# Altium schematic sheet STM32H743VIT6_Core.SchDoc
size A2
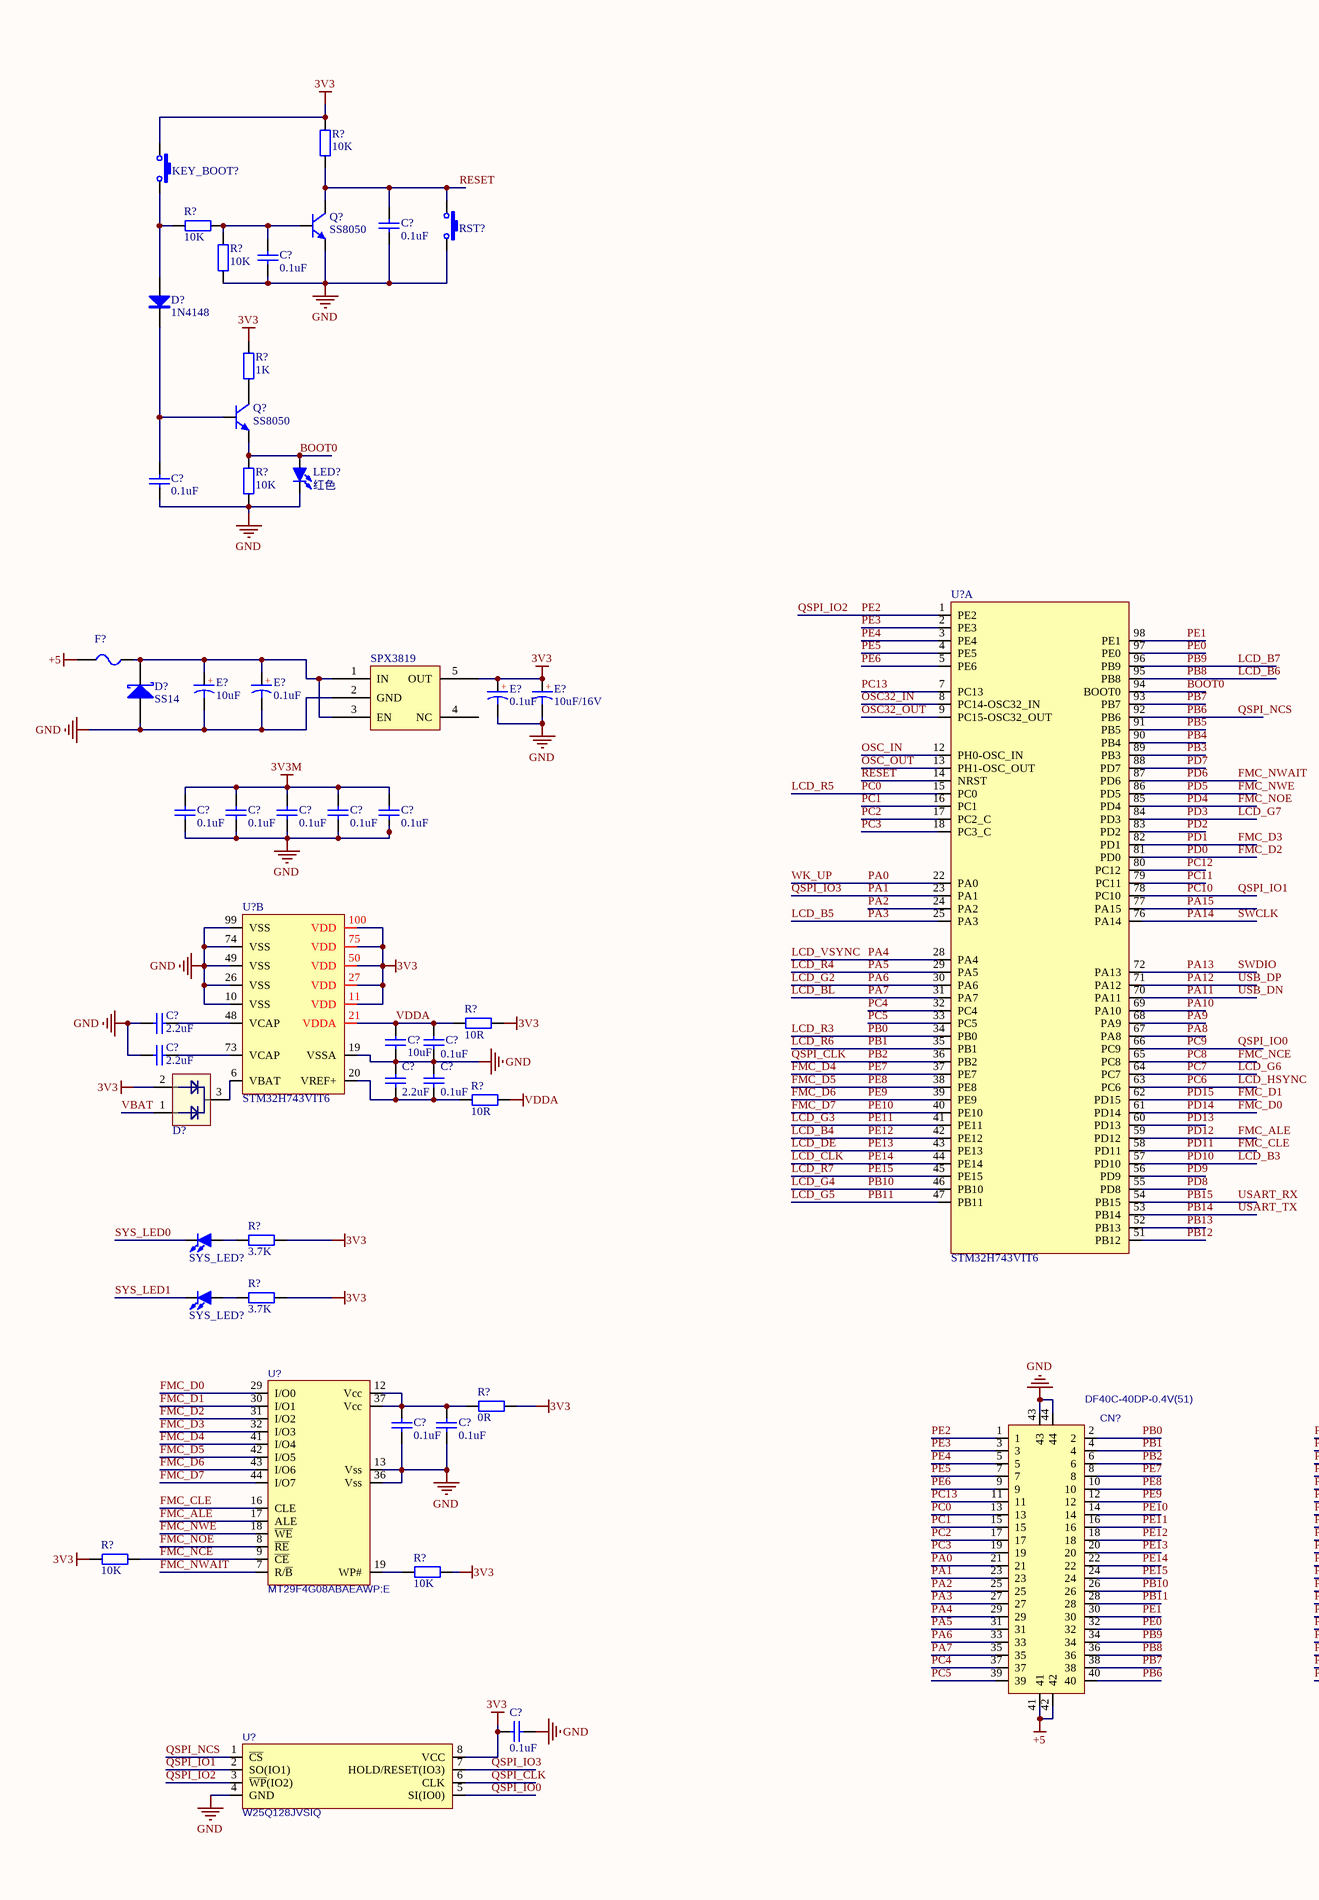
[diagram p0: STM32H743VIT6_Core.SchDoc, left]
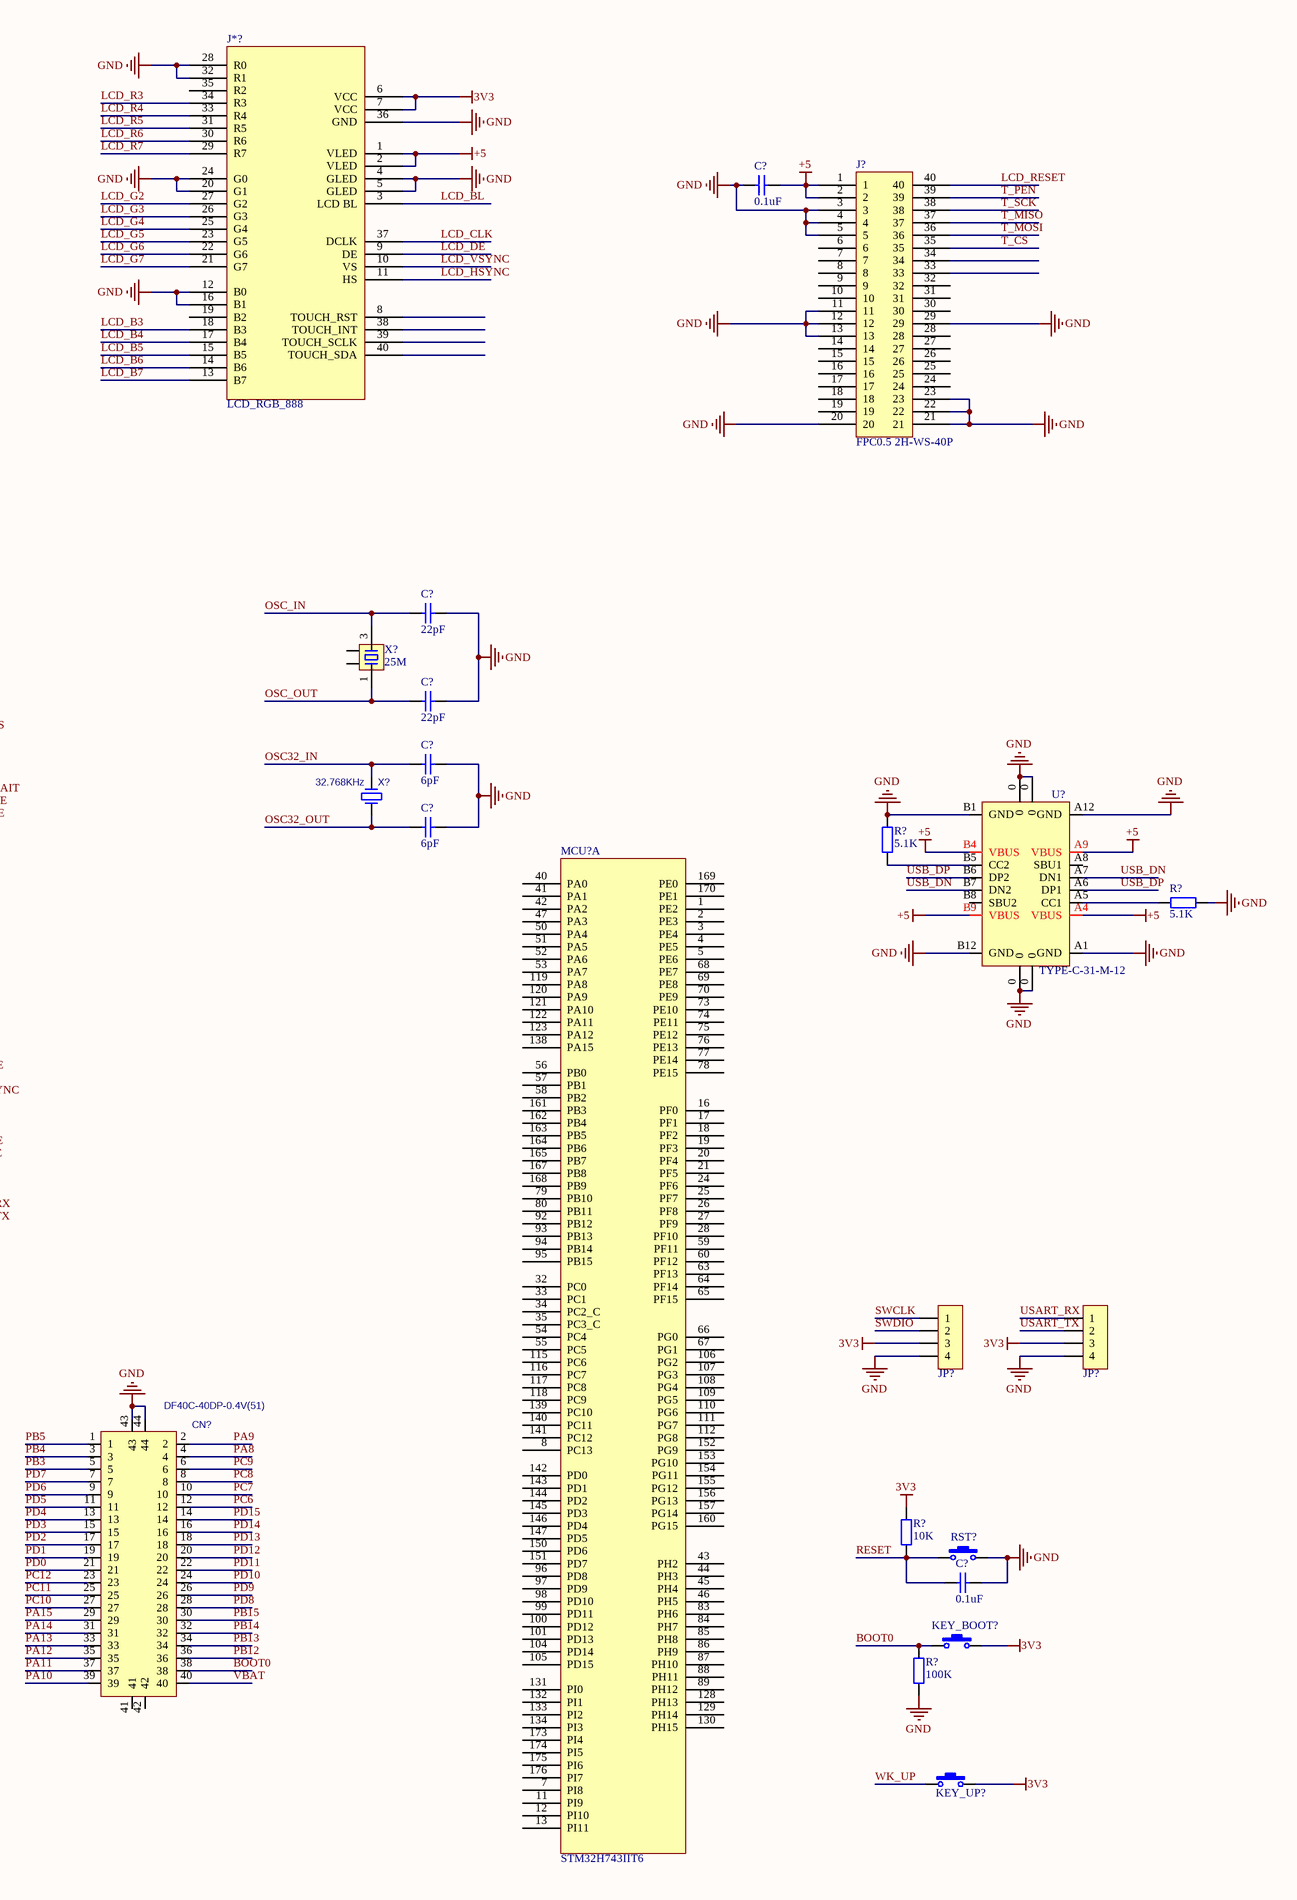
[diagram p1: STM32H743VIT6_Core.SchDoc, right]

## Parts
(Parts that share a designator on the sheet are numbered #1, #2 ... from top to bottom, then left to right.)
C?#1  0.1uF  [C0603_L]
C?#2  0.1uF  [C0603_L]
C?#3  0.1uF  [C0603_L]
C?#4  0.1uF  [C0603_L]
C?#5  22pF  [C0603_L]
C?#6  22pF  [C0603_L]
C?#7  6pF  [C0603_L]
C?#8  6pF  [C0603_L]
C?#9  0.1uF  [C0603_L]
C?#10  0.1uF  [C0603_L]
C?#11  0.1uF  [C0603_L]
C?#12  0.1uF  [C0603_L]
C?#13  0.1uF  [C0603_L]
C?#14  2.2uF  [C0603_L]
C?#15  10uF  [C0603_L]
C?#16  0.1uF  [C0603_L]
C?#17  2.2uF  [C0603_L]
C?#18  2.2uF  [C0603_L]
C?#19  0.1uF  [C0603_L]
C?#20  0.1uF  [C0603_L]
C?#21  0.1uF  [C0603_L]
C?#22  0.1uF  [C0603_L]
C?#23  0.1uF  [C0603_L]
CN?#1  DF40C-40DP-0.4V(51)  [DF40C-40DP-0.4V]
CN?#2  DF40C-40DP-0.4V(51)  [DF40C-40DP-0.4V]
D?#1  1N4148  [SOD-323]
D?#2  SS14  [SMA]
D?#3  BAT54C  [SOT23-3L]  (value not drawn)
E?#1  10uF  [C_3216]
E?#2  0.1uF  [C_3216]
E?#3  0.1uF  [C_3216]
E?#4  10uF/16V  [C_3216]
F?  MSMD200-8V 1A  [FU 0603]  (value not drawn)
J*?  LCD_RGB_888  [FPC0.5 2H-WS-40P]
J?  FPC0.5 2H-WS-40P  [FPC0.5 2H-WS-40P]
JP?#1  HDR-1X4  [HDR2.0-M-LI-4P]  (value not drawn)
JP?#2  HDR-1X4  [HDR2.0-M-LI-4P]  (value not drawn)
KEY_BOOT?#1  3x6x5  [SW 3*6*4.3-S-W]  (value not drawn)
KEY_BOOT?#2  3x6x5  [SW SMD-3*6*2.5]  (value not drawn)
KEY_UP?  3x6x5  [SW SMD-3*6*2.5]  (value not drawn)
LED?  红色  [LED0603_B]
MCU?  STM32H743IIT6  [LQFT-176]  (part A of 2)
Q?#1  SS8050  [SOT23-3N]
Q?#2  SS8050  [SOT23-3N]
R?#1  10K  [R0603_L]
R?#2  10K  [R0603_L]
R?#3  10K  [R0603_L]
R?#4  1K  [R0603_L]
R?#5  10K  [R0603_L]
R?#6  5.1K  [R0603_L]
R?#7  5.1K  [R0603_L]
R?#8  10R  [R0603_L]
R?#9  10R  [R0603_L]
R?#10  3.7K  [R0603_L]
R?#11  3.7K  [R0603_L]
R?#12  0R  [R0603_L]
R?#13  10K  [R0603_L]
R?#14  10K  [R0603_L]
R?#15  10K  [R0603_L]
R?#16  100K  [R0603_L]
RST?#1  3x6x5  [SW 3*6*4.3-S-W]  (value not drawn)
RST?#2  3x6x5  [SW SMD-3*6*2.5]  (value not drawn)
SYS_LED?#1  红色  [LED0603_G]  (value not drawn)
SYS_LED?#2  红色  [LED0603_G]  (value not drawn)
U?#1  SPX3819  [SOT23-5L]
U?#2  TYPE-C-31-M-12  [TYPE-C-31-M-12]
U?#3  STM32H743VIT6  [LQFP-100]  (part B of 2)
U?#4  STM32H743VIT6  [LQFP-100]  (part A of 2)
U?#5  MT29F4G08ABAEAWP:E  [TSOP-48]
U?#6  W25Q128JVSIQ  [SOIC-8]
X?#1  25M  [OSC 3225-4P]
X?#2  32.768KHz  [SMD3215-2P]

## Nets
3V3: C?#23.1 D?#3.2 E?#3.1(A) E?#4.1(A) J*?.6(VCC) J*?.7(VCC) JP?#1.3 JP?#2.3 KEY_BOOT?#1.1 KEY_BOOT?#2.2 KEY_UP?.2 R?#1.1 R?#4.2 R?#8.2 R?#10.2 R?#11.2 R?#12.2 R?#13.1 R?#14.1 R?#15.2 U?#1.5(OUT) U?#3.11(VDD) U?#3.27(VDD) U?#3.50(VDD) U?#3.75(VDD) U?#3.100(VDD) U?#6.8(VCC)
3V3M: C?#9.2 C?#10.2 C?#11.2 C?#12.2 C?#13.2
+5: C?#1.2 CN?#1.41 CN?#1.42 F?.1 J*?.1(VLED) J*?.2(VLED) J?.1 J?.2 U?#2.A4(VBUS) U?#2.A9(VBUS) U?#2.B4(VBUS) U?#2.B9(VBUS)
GND: C?#1.1 C?#2.2 C?#3.2 C?#4.2 C?#5.1 C?#6.1 C?#7.1 C?#8.1 C?#9.1 C?#10.1 C?#11.1 C?#12.1 C?#13.1 C?#14.1 C?#15.1 C?#16.1 C?#17.1 C?#18.2 C?#19.2 C?#20.1 C?#21.1 C?#22.1 C?#23.2 CN?#1.43 CN?#1.44 CN?#2.43 CN?#2.44 D?#2.1(A) E?#1.2(K) E?#2.2(K) E?#3.2(K) E?#4.2(K) J*?.4(GLED) J*?.5(GLED) J*?.12(B0) J*?.16(B1) J*?.20(G1) J*?.24(G0) J*?.28(R0) J*?.32(R1) J*?.36(GND) J?.3 J?.4 J?.5 J?.11 J?.12 J?.13 J?.20 J?.21 J?.22 J?.23 J?.29 JP?#1.4 JP?#2.4 LED?.2(K) Q?#1.2(E) R?#3.1 R?#5.2 R?#6.2 R?#7.1 R?#16.2 RST?#1.2 RST?#2.2 U?#1.2(GND) U?#2.0 U?#2.A1(GND) U?#2.A12(GND) U?#2.B1(GND) U?#2.B12(GND) U?#3.10(VSS) U?#3.19(VSSA) U?#3.26(VSS) U?#3.49(VSS) U?#3.74(VSS) U?#3.99(VSS) U?#5.13(Vss) U?#5.36(Vss) U?#6.4(GND)
VDDA: C?#15.2 C?#16.2 R?#8.1 R?#9.2 U?#3.21(VDDA)
BOOT0: CN?#2.38 KEY_BOOT?#2.1 LED?.1(A) Q?#2.2(E) R?#5.1 R?#16.1 U?#4.94(BOOT0)
FMC_ALE: CN?#2.20 U?#4.59(PD12) U?#5.17(ALE)  [also labelled PD12]
FMC_CLE: CN?#2.22 U?#4.58(PD11) U?#5.16(CLE)  [also labelled PD11]
FMC_D0: CN?#2.16 U?#4.61(PD14) U?#5.29(I/O0)  [also labelled PD14]
FMC_D1: CN?#2.14 U?#4.62(PD15) U?#5.30(I/O1)  [also labelled PD15]
FMC_D2: CN?#2.21 U?#4.81(PD0) U?#5.31(I/O2)  [also labelled PD0]
FMC_D3: CN?#2.19 U?#4.82(PD1) U?#5.32(I/O3)  [also labelled PD1]
FMC_D4: CN?#1.8 U?#4.37(PE7) U?#5.41(I/O4)  [also labelled PE7]
FMC_D5: CN?#1.10 U?#4.38(PE8) U?#5.42(I/O5)  [also labelled PE8]
FMC_D6: CN?#1.12 U?#4.39(PE9) U?#5.43(I/O6)  [also labelled PE9]
FMC_D7: CN?#1.14 U?#4.40(PE10) U?#5.44(I/O7)  [also labelled PE10]
FMC_NCE: CN?#2.8 R?#14.2 U?#4.65(PC8) U?#5.9(~{CE})  [also labelled PC8]
FMC_NOE: CN?#2.13 U?#4.85(PD4) U?#5.8(~{RE})  [also labelled PD4]
FMC_NWAIT: CN?#2.9 U?#4.87(PD6) U?#5.7(R/~{B})  [also labelled PD6]
FMC_NWE: CN?#2.11 U?#4.86(PD5) U?#5.18(~{WE})  [also labelled PD5]
LCD_B3: CN?#2.24 J*?.18(B3) U?#4.57(PD10)  [also labelled PD10]
LCD_B4: CN?#1.18 J*?.17(B4) U?#4.42(PE12)  [also labelled PE12]
LCD_B5: CN?#1.27 J*?.15(B5) U?#4.25(PA3)  [also labelled PA3]
LCD_B6: CN?#1.36 J*?.14(B6) U?#4.95(PB8)  [also labelled PB8]
LCD_B7: CN?#1.34 J*?.13(B7) U?#4.96(PB9)  [also labelled PB9]
LCD_BL: CN?#1.35 J*?.3(LCD_BL) U?#4.31(PA7)  [also labelled PA7]
LCD_CLK: CN?#1.22 J*?.37(DCLK) U?#4.44(PE14)  [also labelled PE14]
LCD_DE: CN?#1.20 J*?.9(DE) U?#4.43(PE13)  [also labelled PE13]
LCD_G2: CN?#1.33 J*?.27(G2) U?#4.30(PA6)  [also labelled PA6]
LCD_G3: CN?#1.16 J*?.26(G3) U?#4.41(PE11)  [also labelled PE11]
LCD_G4: CN?#1.26 J*?.25(G4) U?#4.46(PB10)  [also labelled PB10]
LCD_G5: CN?#1.28 J*?.23(G5) U?#4.47(PB11)  [also labelled PB11]
LCD_G6: CN?#2.10 J*?.22(G6) U?#4.64(PC7)  [also labelled PC7]
LCD_G7: CN?#2.15 J*?.21(G7) U?#4.84(PD3)  [also labelled PD3]
LCD_HSYNC: CN?#2.12 J*?.11(HS) U?#4.63(PC6)  [also labelled PC6]
LCD_R3: CN?#1.2 J*?.34(R3) U?#4.34(PB0)  [also labelled PB0]
LCD_R4: CN?#1.31 J*?.33(R4) U?#4.29(PA5)  [also labelled PA5]
LCD_R5: CN?#1.13 J*?.31(R5) U?#4.15(PC0)  [also labelled PC0]
LCD_R6: CN?#1.4 J*?.30(R6) U?#4.35(PB1)  [also labelled PB1]
LCD_R7: CN?#1.24 J*?.29(R7) U?#4.45(PE15)  [also labelled PE15]
LCD_RESET: J?.40
LCD_VSYNC: CN?#1.29 J*?.10(VS) U?#4.28(PA4)  [also labelled PA4]
OSC32_IN: C?#7.2 U?#4.8(PC14-OSC32_IN) X?#2.2
OSC32_OUT: C?#8.2 U?#4.9(PC15-OSC32_OUT) X?#2.1
OSC_IN: C?#5.2 U?#4.12(PH0-OSC_IN) X?#1.3
OSC_OUT: C?#6.2 U?#4.13(PH1-OSC_OUT) X?#1.1
PA0: CN?#1.21 KEY_UP?.1 U?#4.22(PA0)  [also labelled WK_UP]
PA1: CN?#1.23 U?#4.23(PA1) U?#6.7(HOLD/RESET(IO3))  [also labelled QSPI_IO3]
PA2: CN?#1.25 U?#4.24(PA2)
PA8: CN?#2.4 U?#4.67(PA8)
PA9: CN?#2.2 U?#4.68(PA9)
PA10: CN?#2.39 U?#4.69(PA10)
PA11: CN?#2.37 U?#2.A7(DN1) U?#2.B7(DN2) U?#4.70(PA11)  [also labelled USB_DN]
PA12: CN?#2.35 U?#2.A6(DP1) U?#2.B6(DP2) U?#4.71(PA12)  [also labelled USB_DP]
PA13: CN?#2.33 JP?#1.2 U?#4.72(PA13)  [also labelled SWDIO]
PA14: CN?#2.31 JP?#1.1 U?#4.76(PA14)  [also labelled SWCLK]
PA15: CN?#2.29 U?#4.77(PA15)
PB2: CN?#1.6 U?#4.36(PB2) U?#6.6(CLK)  [also labelled QSPI_CLK]
PB3: CN?#2.5 U?#4.89(PB3)
PB4: CN?#2.3 U?#4.90(PB4)
PB5: CN?#2.1 U?#4.91(PB5)
PB6: CN?#1.40 U?#4.92(PB6) U?#6.1(~{CS})  [also labelled QSPI_NCS]
PB7: CN?#1.38 U?#4.93(PB7)
PB12: CN?#2.36 U?#4.51(PB12)
PB13: CN?#2.34 U?#4.52(PB13)
PB14: CN?#2.32 JP?#2.2 U?#4.53(PB14)  [also labelled USART_TX]
PB15: CN?#2.30 JP?#2.1 U?#4.54(PB15)  [also labelled USART_RX]
PC1: CN?#1.15 U?#4.16(PC1)
PC2: CN?#1.17 U?#4.17(PC2_C)
PC3: CN?#1.19 U?#4.18(PC3_C)
PC4: CN?#1.37 U?#4.32(PC4)
PC5: CN?#1.39 U?#4.33(PC5)
PC9: CN?#2.6 U?#4.66(PC9) U?#6.5(SI(IO0))  [also labelled QSPI_IO0]
PC10: CN?#2.27 U?#4.78(PC10) U?#6.2(SO(IO1))  [also labelled QSPI_IO1]
PC11: CN?#2.25 U?#4.79(PC11)
PC12: CN?#2.23 U?#4.80(PC12)
PC13: CN?#1.11 U?#4.7(PC13)
PD2: CN?#2.17 U?#4.83(PD2)
PD7: CN?#2.7 U?#4.88(PD7)
PD8: CN?#2.28 U?#4.55(PD8)
PD9: CN?#2.26 U?#4.56(PD9)
PD13: CN?#2.18 U?#4.60(PD13)
PE0: CN?#1.32 U?#4.97(PE0)
PE1: CN?#1.30 U?#4.98(PE1)
PE2: CN?#1.1 U?#4.1(PE2) U?#6.3(~{WP}(IO2))  [also labelled QSPI_IO2]
PE3: CN?#1.3 U?#4.2(PE3)
PE4: CN?#1.5 U?#4.3(PE4)
PE5: CN?#1.7 U?#4.4(PE5)
PE6: CN?#1.9 U?#4.5(PE6)
RESET: C?#2.1 C?#22.2 Q?#1.3(C) R?#1.2 R?#13.2 RST?#1.1 RST?#2.1 U?#4.14(NRST)
SYS_LED0: SYS_LED?#1.2(K)
SYS_LED1: SYS_LED?#2.2(K)
T_CS: J?.35
T_MISO: J?.37
T_MOSI: J?.36
T_PEN: J?.39
T_SCK: J?.38
VBAT: CN?#2.40 D?#3.1
NetC?#3_1: C?#3.1 Q?#1.1(B) R?#2.2 R?#3.2
NetC?#4_1: C?#4.1 D?#1.2(K) Q?#2.1(B)
NetC?#14_2: C?#14.2 U?#3.48(VCAP)
NetC?#17_2: C?#17.2 U?#3.73(VCAP)
NetC?#18_1: C?#18.1 C?#19.1 R?#9.1 U?#3.20(VREF+)
NetC?#20_2: C?#20.2 C?#21.2 R?#12.1 U?#5.12(Vcc) U?#5.37(Vcc)
NetD?#1_1: D?#1.1(A) KEY_BOOT?#1.2 R?#2.1
NetD?#2_2: D?#2.2(K) E?#1.1(A) E?#2.1(A) F?.2 U?#1.1(IN) U?#1.3(EN)
NetD?#3_3: D?#3.3 U?#3.6(VBAT)
NetQ?#2_3: Q?#2.3(C) R?#4.1
NetR?#6_1: R?#6.1 U?#2.B5(CC2)
NetR?#7_2: R?#7.2 U?#2.A5(CC1)
NetR?#10_1: R?#10.1 SYS_LED?#1.1(A)
NetR?#11_1: R?#11.1 SYS_LED?#2.1(A)
NetR?#15_1: R?#15.1 U?#5.19(WP#)

Not connected (* = marked no-connect by the designer): CN?#2 41 42; J*? 8(TOUCH_RST) 19(B2) 35(R2) 38(TOUCH_INT) 39(TOUCH_SCLK) 40(TOUCH_SDA); J? 6 7 8 9 10 14 15 16 17 18 19 24 25 26 27 28 30 31 32 33 34; MCU? 1(PE2) 2(PE3) 3(PE4) 4(PE5) 5(PE6) 7(PI8) 8(PC13) 11(PI9) 12(PI10) 13(PI11) 16(PF0) 17(PF1) 18(PF2) 19(PF3) 20(PF4) 21(PF5) 24(PF6) 25(PF7) 26(PF8) 27(PF9) 28(PF10) 32(PC0) 33(PC1) 34(PC2_C) 35(PC3_C) 40(PA0) 41(PA1) 42(PA2) 43(PH2) 44(PH3) 45(PH4) 46(PH5) 47(PA3) 50(PA4) 51(PA5) 52(PA6) 53(PA7) 54(PC4) 55(PC5) 56(PB0) 57(PB1) 58(PB2) 59(PF11) 60(PF12) 63(PF13) 64(PF14) 65(PF15) 66(PG0) 67(PG1) 68(PE7) 69(PE8) 70(PE9) 73(PE10) 74(PE11) 75(PE12) 76(PE13) 77(PE14) 78(PE15) 79(PB10) 80(PB11) 83(PH6) 84(PH7) 85(PH8) 86(PH9) 87(PH10) 88(PH11) 89(PH12) 92(PB12) 93(PB13) 94(PB14) 95(PB15) 96(PD8) 97(PD9) 98(PD10) 99(PD11) 100(PD12) 101(PD13) 104(PD14) 105(PD15) 106(PG2) 107(PG3) 108(PG4) 109(PG5) 110(PG6) 111(PG7) 112(PG8) 115(PC6) 116(PC7) 117(PC8) 118(PC9) 119(PA8) 120(PA9) 121(PA10) 122(PA11) 123(PA12) 128(PH13) 129(PH14) 130(PH15) 131(PI0) 132(PI1) 133(PI2) 134(PI3) 138(PA15) 139(PC10) 140(PC11) 141(PC12) 142(PD0) 143(PD1) 144(PD2) 145(PD3) 146(PD4) 147(PD5) 150(PD6) 151(PD7) 152(PG9) 153(PG10) 154(PG11) 155(PG12) 156(PG13) 157(PG14) 160(PG15) 161(PB3) 162(PB4) 163(PB5) 164(PB6) 165(PB7) 167(PB8) 168(PB9) 169(PE0) 170(PE1) 173(PI4) 174(PI5) 175(PI6) 176(PI7); U?#1 4(NC); U?#2 A8(SBU1) B8(SBU2); U?#5 1(NC) 2(NC) 3(NC) 4(NC) 5(NC) 6(NC) 10(NC) 11(NC) 14(NC) 15(NC) 20(DNU) 21(DNU) 22(DNU) 23(NC) 24(NC) 25(NC) 26(NC) 27(NC) 28(NC) 33(NC) 34(NC) 35(NC) 38(PRE/VSS) 39(NC) 40(NC) 45(NC) 46(NC) 47(NC) 48(NC); X?#1 2 4

## Notes on the sheet
- (in symbol CT) +

## Library data of the parts
C?#1-C?#23 = C: 贴片电容; BOM名称: 无极性贴片电容; 联系卖家，免费查找封装: 唯一出售店铺网址https://shop463601444.taobao.com; 封装库来自淘宝卖家ID：黄晶宝石: 其他店铺购入均为盗版假冒封装库，请立即申请退款
CN?#1 CN?#2 = DF40C-40DP-0.4V(51): C424643; BOM_Manufacturer: HRS(广濑); Contributor: LCSC; BOM_Supplier: LCSC; BOM_Supplier Part: C424643; BOM_Manufacturer Part: DF40C-40DP-0.4V(51); BOM_JLCPCB Part Class: Extended Part; spicePre: C; spiceSymbolName: DF40C-40DP-0.4V(51)
D?#1 = 1N4148: 开关二极管; BOM名称: 高速开关二极管; 联系卖家，免费查找封装: 唯一出售店铺网址https://shop463601444.taobao.com
D?#2 = SS14: 肖特基二极管; 属性: 40V/1A; 联系卖家，免费查找封装: 唯一出售店铺网址https://shop463601444.taobao.com; BOM名称: 肖特基二极管
D?#3 = BAT54C: 两路肖特基二极管
E?#1-E?#4 = CT: 贴片钽电容; 联系卖家，免费查找封装: 唯一出售店铺网址https://shop463601444.taobao.com; 封装库来自淘宝卖家ID：黄晶宝石: 其他店铺购入均为盗版假冒封装库，请立即申请退款; BOM名称: 贴片钽电容
F? = FU: 贴片保险丝; 联系卖家，免费查找封装: 唯一出售店铺网址https://shop463601444.taobao.com; BOM名称: 贴片保险丝
J*? = LCD_RGB_888: AT070TN83 或者反客
JP?#1 JP?#2 = Header 4: 4P接插件; 封装库来自淘宝卖家 ID：黄晶宝石: 其他店铺购入均为盗版，不享受售后技术支持服务，请立即申请退款
KEY_BOOT?#1 KEY_BOOT?#2 KEY_UP? RST?#1 RST?#2 = SW-PB: 微动开关; BOM名称: 3x6轻触开关; 联系卖家，免费查找封装: 唯一出售店铺网址https://shop463601444.taobao.com
LED? SYS_LED?#1 SYS_LED?#2 = LED-SMD: 贴片LED; 封装库来自淘宝卖家 ID：黄晶宝石: 其他店铺购入均为假冒，请立即申请退款，本店奖励现金5~20元; BOM名称: 贴片LED
Q?#1 Q?#2 = 8050-SMD: 高频放大-NPN型; 联系卖家，免费查找封装: 唯一出售店铺网址https://shop463601444.taobao.com; 封装库来自淘宝卖家 ID：黄晶宝石: 其他店铺购入均为盗版，不享受售后技术支持服务，请立即申请退款; 参数: 40V 1.5A 1W 100MHZ; BOM名称: 高频放大-NPN型
R?#1-R?#16 = R: 贴片电阻; 联系卖家，免费查找封装: 唯一出售店铺网址https://shop463601444.taobao.com; 封装库来自淘宝卖家ID：黄晶宝石: 其他店铺购入均为盗版假冒封装库，请立即申请退款; BOM名称: 贴片电阻
U?#5 = MT29F4G08ABAEAWP:E: C496612; BOM_Manufacturer: micron(镁光); Contributor: LCSC; BOM_Supplier: LCSC; BOM_Supplier Part: C496612; BOM_Manufacturer Part: MT29F4G08ABAEAWP:E; BOM_JLCPCB Part Class: Extended Part; spicePre: U; spiceSymbolName: MT29F4G08ABAEAWP:E
U?#6 = W25Q128: SPI FLASH; 封装库来自 淘宝卖家 ID：黄晶宝石: 其他店铺购入均为盗版假冒封装库，请立即申请退款
X?#1 = XTAL-4P: 4脚无源晶振; 联系卖家，免费查找封装: 唯一出售店铺网址https://shop463601444.taobao.com; BOM名称: 4脚无源晶振
X?#2 = 32.768KHz: 立创商城:C48615; BOM_Manufacturer Part: Q13FC1350000200; BOM_Manufacturer: EPSON; nameAlias: Frequency; BOM_Supplier: LCSC; BOM_Supplier Part: C48615; BOM_JLCPCB Part Class: Extended Part; spicePre: X; spiceSymbolName: Q13FC1350000200